# EAGLE design updi_programmer (EAGLE 9.5.2)
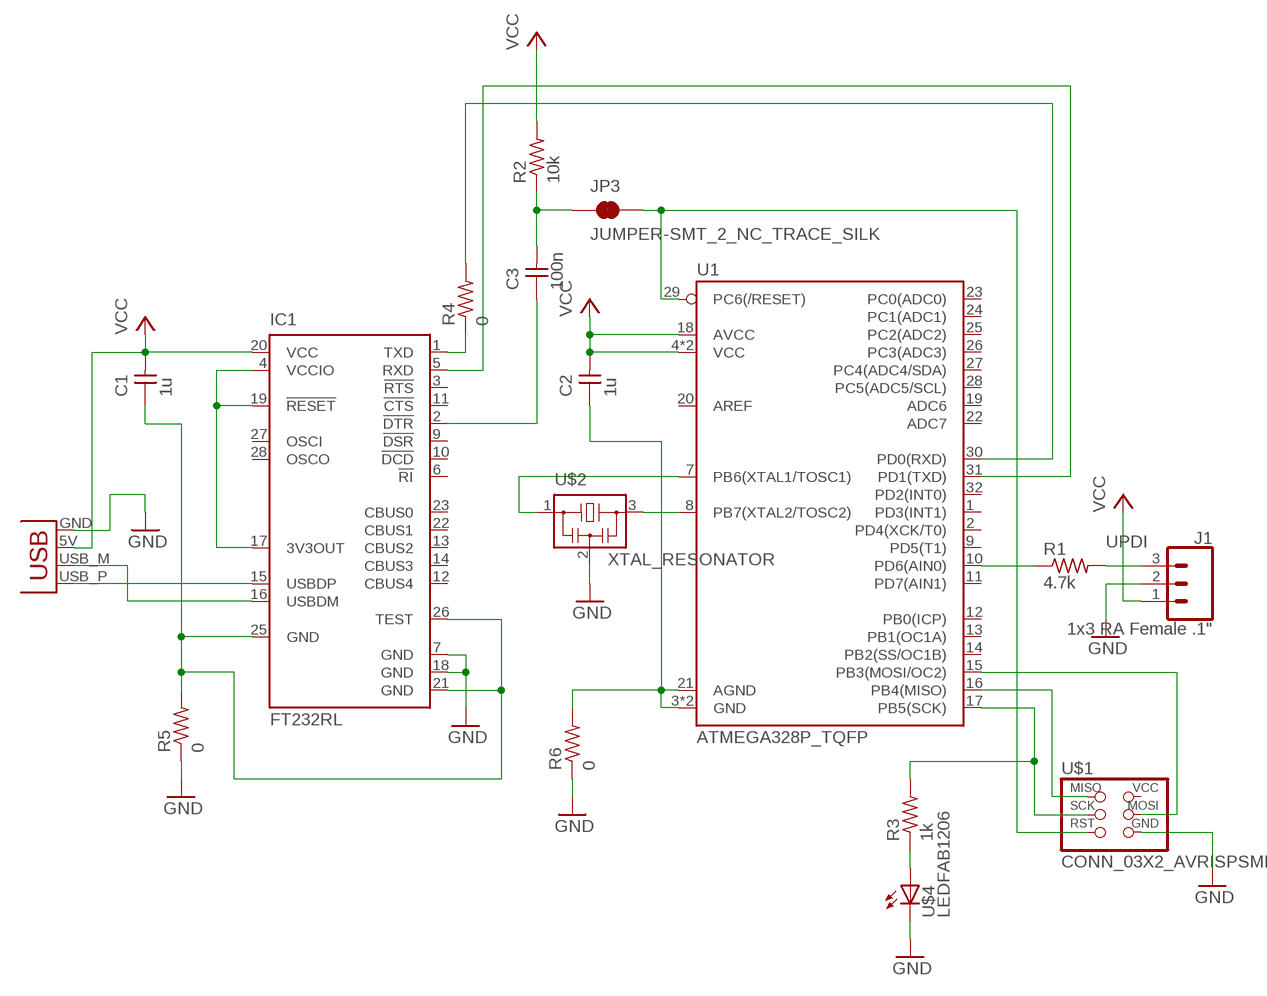
[diagram p0: schematic, sheet 1]

## Parts
C1  1u  CAP_UNPOLARIZEDFAB  [C1206FAB]
C2  1u  CAP_UNPOLARIZEDFAB  [C1206FAB]
C3  100n  CAP_UNPOLARIZEDFAB  [C1206FAB]
IC1  FT232RL  [SSOP28]
J1  1x3 RA Female .1"  CONN_03SMD_RA_FEMALE  [1X03_SMD_RA_FEMALE]
JP3  JUMPER-SMT_2_NC_TRACE_SILK  [SMT-JUMPER_2_NC_TRACE_SILK]
R1  4.7k  R1206FAB  [R1206FAB]
R2  10k  R1206FAB  [R1206FAB]
R3  1k  R1206FAB  [R1206FAB]
R4  0  R1206FAB  [R1206FAB]
R5  0  R1206FAB  [R1206FAB]
R6  0  R1206FAB  [R1206FAB]
U1  ATMEGA328P_TQFP  [TQFP32-08]
U$1  CONN_03X2_AVRISPSMD  [2X03SMD]
U$2  XTAL_RESONATOR  [EFOBM]
U$4  LEDFAB1206  [LED1206FAB]
X1  CONN_USBPCB  [USB-A-PCB]

## Nets
GND: IC1.7(GND) IC1.18(GND) J1.2 R5.1 R6.1 U$1.6(GND) U$2.2 U$4.2(C) X1.GND
N$1: IC1.1(TXD) R4.1
N$2: IC1.4(VCCIO) IC1.17(3V3OUT) IC1.19(!RESET)
N$3: IC1.15(USBDP) X1.USB_P(D+)
N$4: IC1.16(USBDM) X1.USB_M(D-)
N$5: U1.8(PB7(XTAL2/TOSC2)) U$2.3
N$6: U1.7(PB6(XTAL1/TOSC1)) U$2.1
N$7: R3.1 U$4.1(A)
N$8: C3.2 JP3.1 R2.1
N$9: U1.16(PB4(MISO)) U$1.1(MISO)
N$10: R1.1 U1.10(PD6(AIN0))
N$11: R3.2 U1.17(PB5(SCK)) U$1.3(SCK)
N$12: U1.15(PB3(MOSI/OC2)) U$1.4(MOSI)
N$13: JP3.2 U1.29(PC6(/RESET)) U$1.5(RST)
N$14: C3.1 IC1.2(!DTR)
N$15: R4.2 U1.30(PD0(RXD))
N$16: IC1.5(RXD) U1.31(PD1(TXD))
N$17: C2.1 R6.2 U1.3(GND) U1.5(GND) U1.21(AGND)
N$18: C1.1 IC1.21(GND) IC1.25(GND) IC1.26(TEST) R5.2
UPDI: J1.3 R1.2
VCC: C1.2 C2.2 IC1.20(VCC) J1.1 R2.2 U1.4(VCC) U1.6(VCC) U1.18(AVCC) X1.5V(VBUS)
Unconnected: IC1.3(!RTS) IC1.6(!RI) IC1.9(!DSR) IC1.10(!DCD) IC1.11(!CTS) IC1.12(CBUS4) IC1.13(CBUS2) IC1.14(CBUS3) IC1.22(CBUS1) IC1.23(CBUS0) IC1.27(OSCI) IC1.28(OSCO) U1.1(PD3(INT1)) U1.2(PD4(XCK/T0)) U1.9(PD5(T1)) U1.11(PD7(AIN1)) U1.12(PB0(ICP)) U1.13(PB1(OC1A)) U1.14(PB2(SS/OC1B)) U1.19(ADC6) U1.20(AREF) U1.22(ADC7) U1.23(PC0(ADC0)) U1.24(PC1(ADC1)) U1.25(PC2(ADC2)) U1.26(PC3(ADC3)) U1.27(PC4(ADC4/SDA)) U1.28(PC5(ADC5/SCL)) U1.32(PD2(INT0)) U$1.2(VCC)

## Library data of the parts
C1-C3 = fab:CAP_UNPOLARIZED
IC1 = ftdichip:FT232R: Source: http://www.ftdichip.com/Documents/DataSheets/DS_FT232R_v104.pdf; MPN: FT232RL; OC_FARNELL: 1146032; OC_NEWARK: 91K9918
J1 = SparkFun-Connectors:CONN_03: Multi connection point. Often used as Generic Header-pin footprint for 0.1 inch spaced/style header connections On any of the 0.1 inch spaced packages, you can populate with these: Break Away Headers - Straight <https://www.sparkfun.com/products/116> (PRT-00116) Break Away Male Headers - Right Angle <https://www.sparkfun.com/products/553> (PRT-00553) Female Headers <https://www.sparkfun.com/products/115> (PRT-00115) Break Away Headers - Machine Pin <https://www.sparkfun.com/products/117> (PRT-00117) Break Away Female Headers - Swiss Machine Pin <https://www.sparkfun.com/products/743> (PRT-00743) Stackable Header - 3 Pin (Female, 0.1") <https://www.sparkfun.com/products/13875> (PRT-13875) For SCREWTERMINALS and SPRING TERMINALS visit here: Screw Terimnals on SparkFun.com <https://www.sparkfun.com/search/results?term=Screw+Terminals> (5mm/3.5mm/2.54mm spacing) This device is also useful as a general connection point to wire up your design to another part of your project. Our various solder wires solder well into these plated through hole pads. Hook-Up Wire - Assortment (Stranded, 22 AWG) <https://www.sparkfun.com/products/11375> (PRT-11375) Hook-Up Wire - Assortment (Solid Core, 22 AWG) <https://www.sparkfun.com/products/11367> (PRT-11367) View the entire wire category on our website here <https://www.sparkfun.com/categories/141> Special notes: Molex polarized connector foot print use with SKU : PRT-08232 with associated crimp pins and housings.; PROD_ID: CONN-10926
JP3 = SparkFun-Jumpers:JUMPER-SMT_2_NC_TRACE: Normally closed trace jumper This jumper has a trace between two pads so it's normally closed (NC). Use a razor knife to open the connection. For best results follow the IPC guidelines for cutting traces: Cutout at least 0.063 mm (0.005 in). Remove all loose material to clean up the cut area. Seal the cut with an approved epoxy. Reapply solder to reclose the connection.
R1-R6 = fab:R: Resistor (US Symbol) Variants with postfix FAB are widened to allow the routing of internal traces
U1 = SparkFun-IC-Microcontroller:ATMEGA328P_TQFP: Popular 328P in QFP Storefront component: ATmega328 - TQFP <https://www.sparkfun.com/products/13448> (COM-13448) Datasheet <http://www.sparkfun.com/datasheets/Components/SMD/ATMega328.pdf> SparkFun Products SparkFun RedBoard - Programmed with Arduino <https://www.sparkfun.com/products/12757> (DEV-12757) Arduino Pro Mini 328 - 5V/16MHz <https://www.sparkfun.com/products/11113> (DEV-11113) Arduino Pro Mini 328 - 3.3V/8MHz <https://www.sparkfun.com/products/11114> (DEV-11114) SparkFun OpenLog <https://www.sparkfun.com/products/13712> (DEV-13712) SparkFun MicroView - OLED Arduino Module <https://www.sparkfun.com/products/12923> (DEV-12923) SparkFun Digital Sandbox <https://www.sparkfun.com/products/12651> (DEV-12651) SparkFun PicoBoard <https://www.sparkfun.com/products/11888> (WIG-11888) Arduino Fio <https://www.sparkfun.com/products/10116> (DEV-10116) LilyPad Arduino 328 Main Board <https://www.sparkfun.com/products/13342> (DEV-13342) SparkFun RedStick <https://www.sparkfun.com/products/13741> (DEV-13741) LilyPad MP3 <https://www.sparkfun.com/products/11013> (DEV-11013) LilyPad Arduino SimpleSnap <https://www.sparkfun.com/products/10941> (DEV-10941) SparkFun Stepoko <https://www.sparkfun.com/products/13899> (ROB-13899) SparkFun Geiger Counter <https://www.sparkfun.com/products/11345> (SEN-11345) SparkFun EL Sequencer <https://www.sparkfun.com/products/12781> (COM-12781) Arduino Pro 328 - 5V/16MHz <https://www.sparkfun.com/products/10915> (DEV-10915) CryptoCape <https://www.sparkfun.com/products/12773> (DEV-12773) SparkFun IR Thermometer Evaluation Board - MLX90614 <https://www.sparkfun.com/products/10740> (SEN-10740) SparkFun RedBot Mainboard <https://www.sparkfun.com/products/12097> (ROB-12097) Arduino Pro 328 - 3.3V/8MHz <https://www.sparkfun.com/products/10914> (DEV-10914) SparkFun Block for Intel® Edison - Arduino <https://www.sparkfun.com/products/13036> (DEV-13036) SparkFun Simon Says - Surface Mount Soldering Kit <https://www.sparkfun.com/products/10935> (KIT-10935) SparkFun 7-Segment Serial Display - Red <https://www.sparkfun.com/products/11441> (COM-11441) SparkFun 7-Segment Serial Display - White <https://www.sparkfun.com/products/11629> (COM-11629) SparkFun 7-Segment Serial Display - Yellow <https://www.sparkfun.com/products/11443> (COM-11443) SparkFun 7-Segment Serial Display - Kelly Green <https://www.sparkfun.com/products/11440> (COM-11440) SparkFun 7-Segment Serial Display - Blue <https://www.sparkfun.com/products/11442> (COM-11442) SparkFun OpenSegment Serial Display - 20mm (Blue) <https://www.sparkfun.com/products/11647> (COM-11647) SparkFun OpenSegment Serial Display - 20mm (Green) <https://www.sparkfun.com/products/11646> (COM-11646) SparkFun OpenSegment Serial Display - 20mm (White) <https://www.sparkfun.com/products/11648> (COM-11648) SparkFun OpenSegment Serial Display - 20mm (Red) <https://www.sparkfun.com/products/11644> (COM-11644) SparkFun OpenSegment Serial Display - 20mm (Yellow) <https://www.sparkfun.com/products/11645> (COM-11645) SparkFun OpenSegment Shield <https://www.sparkfun.com/products/13190> (DEV-13190); PROD_ID: IC-09069
U$1 = fab:CONN_03X2_AVRISP
U$2 = fab:XTAL_RESONATOR
U$4 = fab:LED: LED
X1 = fab:CONN_USB: USB Connectors USB-B-PTH is fully proven SKU : PRT-00139 USB-miniB is fully proven SKU : PRT-00587 USB-A-PCB is untested. USB-A-H is throughly reviewed, but untested. Spark Fun Electronics SKU : PRT-00437 USB-B-SMT is throughly reviewed, but untested. Needs silkscreen touching up. USB-A-S has not been used/tested USB-MB-H has not been used/tested

## Board
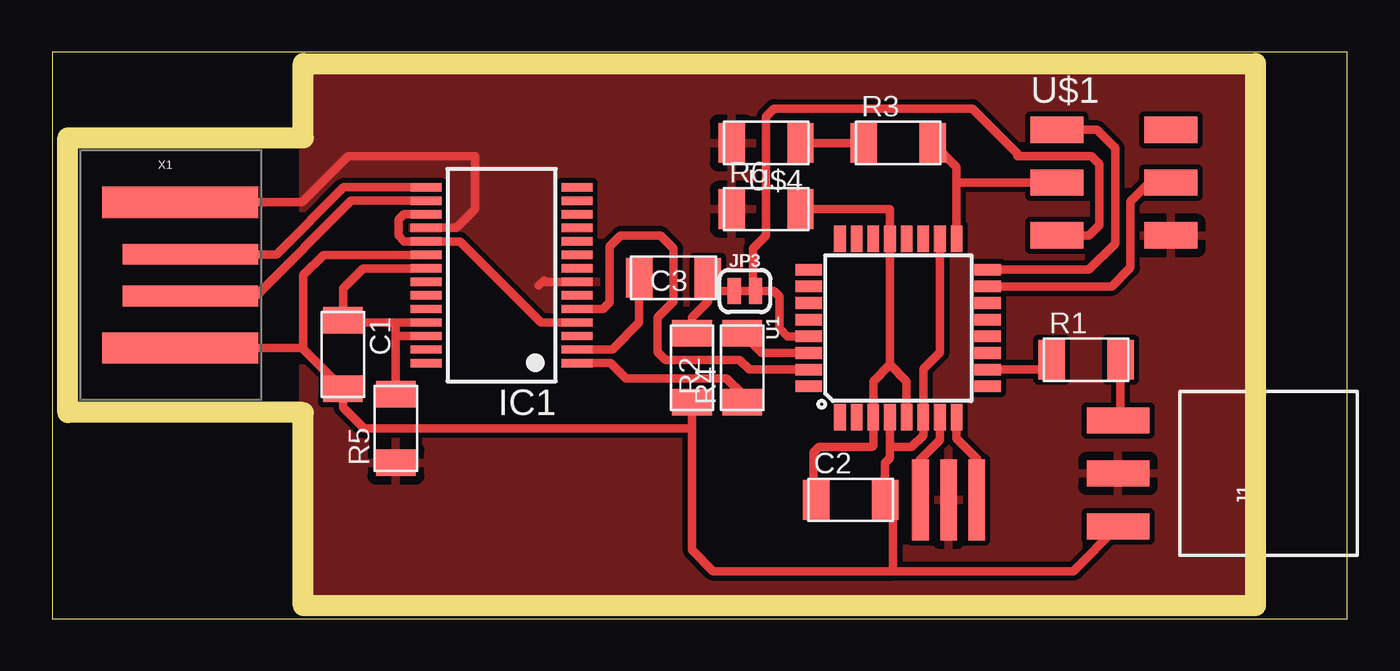
[diagram p1: board, top side]
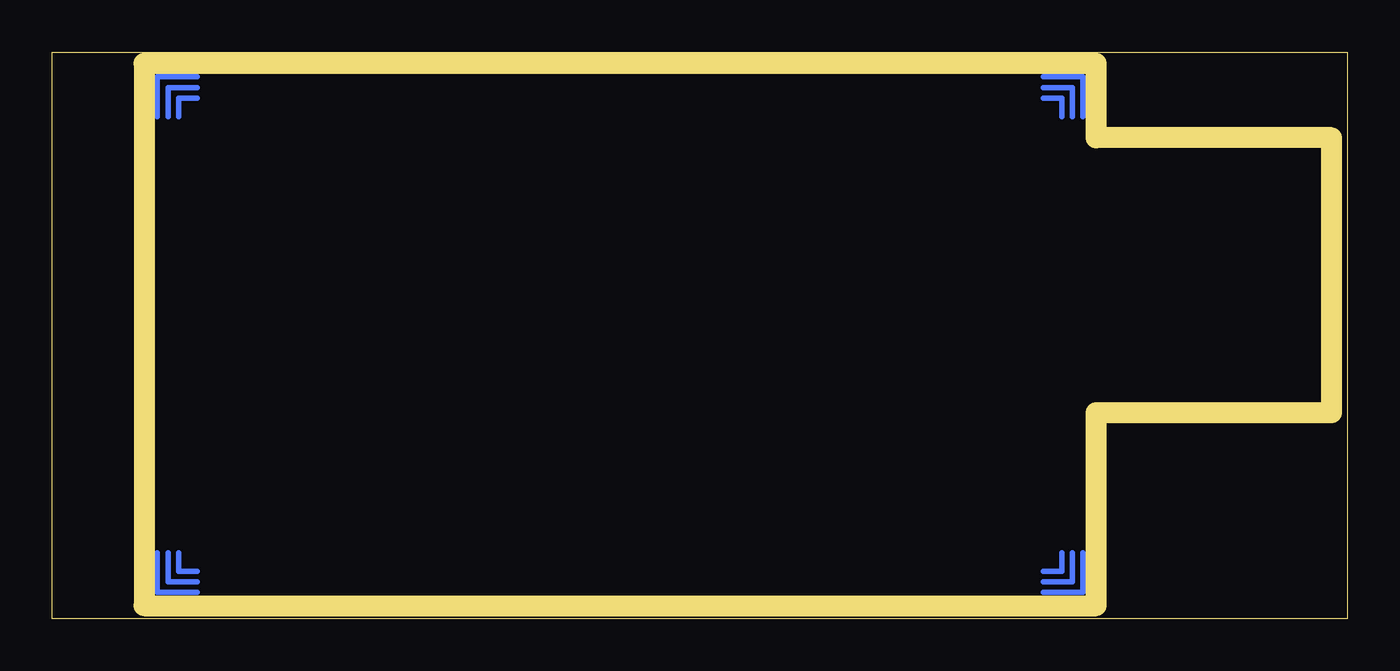
[diagram p2: board, bottom side, seen from below]

Size 62.21 x 27.23 mm. Coordinates in mm from the lower left corner, seen from the top.
Outline: 0,0 62.21,0 62.21,27.23 0,27.23 0,0
Copper layers (1*16): Top 0.035mm / dielectric 1.5mm / Bottom 0.035mm
Design rules "default *": minimum track width 6mil, minimum drill 0.35mm, track to track 8mil, track to pad 8mil, pad to pad 8mil, via to via 8mil, smd to smd 8mil, copper to edge 40mil, drill to drill 6mil, minimum pad ring 10mil, minimum via ring 8mil, stop-mask expansion 4mil, vias tented up to drill 0mil, thermal gap 16mil
Milling: 8 lines

### Footprints (pad centres in the part's own frame; a part is rotated, then mirrored left to right if it is on the bottom)
C1206FAB = smd 1.27 x 1.905: 1 -1.651,0; 2 1.651,0
SSOP28 = smd 0.4 x 1.5: 1 -4.225,-3.625; 2 -3.575,-3.625; 3 -2.925,-3.625; 4 -2.275,-3.625; 5 -1.625,-3.625; 6 -0.975,-3.625; 7 -0.325,-3.625; 8 0.325,-3.625; 9 0.975,-3.625; 10 1.625,-3.625; 11 2.275,-3.625; 12 2.925,-3.625; 13 3.575,-3.625; 14 4.225,-3.625; 15 4.225,3.625; 16 3.575,3.625; 17 2.925,3.625; 18 2.275,3.625; 19 1.625,3.625; 20 0.975,3.625; 21 0.325,3.625; 22 -0.325,3.625; 23 -0.975,3.625; 24 -1.625,3.625; 25 -2.275,3.625; 26 -2.925,3.625; 27 -3.575,3.625; 28 -4.225,3.625
1X03_SMD_RA_FEMALE = smd 1.25 x 3: 1 -2.54,7.225; 2 0,7.225; 3 2.54,7.225
SMT-JUMPER_2_NC_TRACE_SILK = smd 0.635 x 1.27: 1 -0.508,0; 2 0.508,0
R1206FAB = smd 1.27 x 1.905: 1 -1.651,0; 2 1.651,0
TQFP32-08 = smd 1.27 x 0.559: 1 -4.293,2.8; 2 -4.293,2; 3 -4.293,1.2; 4 -4.293,0.4; 5 -4.293,-0.4; 6 -4.293,-1.2; 7 -4.293,-2; 8 -4.293,-2.8; 17 4.293,-2.8; 18 4.293,-2; 19 4.293,-1.2; 20 4.293,-0.4; 21 4.293,0.4; 22 4.293,1.2; 23 4.293,2; 24 4.293,2.8 | smd 0.559 x 1.27: 9 -2.8,-4.293; 10 -2,-4.293; 11 -1.2,-4.293; 12 -0.4,-4.293; 13 0.4,-4.293; 14 1.2,-4.293; 15 2,-4.293; 16 2.8,-4.293; 25 2.8,4.293; 26 2,4.293; 27 1.2,4.293; 28 0.4,4.293; 29 -0.4,4.293; 30 -1.2,4.293; 31 -2,4.293; 32 -2.8,4.293
2X03SMD = smd 2.54 x 1.27: 1 -2.54,2.54; 2 2.92,2.54; 3 -2.54,0; 4 2.92,0; 5 -2.54,-2.54; 6 2.92,-2.54
EFOBM = smd 0.8 x 3.9: 1 -1.35,0; 2 0,0; 3 1.35,0
LED1206FAB = smd 1.27 x 1.905: 1 -1.651,0; 2 1.651,0
USB-A-PCB = smd 7.5 x 1.5: 5V -0.2,-3.5; GND -0.2,3.5 | smd 6.5 x 1: USB_M 0.3,-1; USB_P 0.3,1

### Placement (x,y rotation side)
C1  13.97,12.7 270 top
C2  38.35,5.71 0 top
C3  29.84,16.38 0 top
IC1  21.59,16.51 90 top
J1  58.42,6.99 90 top
JP3  33.27,15.75 0 top
R1  49.66,12.45 0 top
R2  30.73,12.06 270 top
R3  40.64,22.86 0 top
R4  33.15,12.06 90 top
R5  16.51,9.14 90 top
R6  34.29,19.68 0 top
U1  40.64,13.97 90 top
U$1  50.8,20.95 0 top
U$2  43.05,5.71 0 top
U$4  34.29,22.86 180 top
X1  6.35,16.51 0 top

### Tracks (layer width: path | path; a pad name or v marks a point on that pad's centre or on a via)
GND
  Top 0.406: IC1.18 19.42,18.79 20.32,19.68 20.32,22.23 14.22,22.23 12.01,20.01 9.53,20.01 9.21,20.32 3.81,20.32 4.12,20.01 X1.GND | IC1.7 23.69,16.18 23.62,16.26 23.37,16
  pour Top (isolate 0.254): 12.06,0.64 12.06,26.67 57.78,26.67 57.78,0.64
N$1
  Top 0.406: IC1.1 26.83,12.29 27.56,11.56 32.38,11.56 33.15,10.79 R4.1
N$2
  Top 0.406: IC1.4 23.48,14.23 19.58,18.14 IC1.19 16.92,18.14 16.64,18.41 16.64,19.18 16.89,19.43 IC1.17
N$3
  Top 0.406: X1.USB_P 10.78,17.51 14,20.73 IC1.15
N$4
  Top 0.406: X1.USB_M 9.79,15.51 14.37,20.09 IC1.16
N$5
  Top 0.406: U1.8 43.44,8.66 44.45,7.65 44.45,6.99 44.4,6.94 U$2.3
N$6
  Top 0.406: U$2.1 41.66,5.76 41.66,7.62 42.64,8.6 U1.7
N$7
  Top 0.406: R3.1 U$4.1
N$8
  Top 0.406: R2.1 30.73,14.48 31.5,15.24 31.5,15.88 | 32.64,15.75 JP3.1 31.62,15.75 31.5,15.88 | 31.5,15.88 C3.2
N$9
  Top 0.406: U1.16 49.79,16.77 51.05,18.03 51.05,22.61 50.16,23.5 U$1.1
N$10
  Top 0.406: R1.1 47.53,11.97 U1.10
N$11
  Top 0.406: R3.2 43.44,21.71 43.44,20.95 | U1.17 43.44,20.95 | U$1.3 43.44,20.95
N$12
  Top 0.406: U$1.4 52.7,20.95 51.79,20.04 51.79,16.86 50.9,15.97 U1.15
N$13
  Top 0.406: U1.29 35.33,13.57 34.92,13.97 34.92,15.49 34.67,15.75 JP3.2 | JP3.2 33.66,15.88 33.66,17.78 34.29,18.41 34.29,24.13 34.67,24.51 44.2,24.51 46.35,22.35 46.35,22.23 49.91,22.23 50.29,21.84 50.29,18.92 49.78,18.41 U$1.5 | JP3.2 32.77,15.75
N$14
  Top 0.406: IC1.2 26.91,12.94 28.19,14.22 C3.1
N$15
  Top 0.406: U1.30 34.09,12.77 R4.2
N$16
  Top 0.406: IC1.5 26.47,14.88 26.77,15.19 26.77,17.88 27.3,18.41 29.21,18.41 29.84,17.78 29.84,15.24 29.08,14.48 29.08,12.83 29.46,12.45 33.02,12.45 33.5,11.97 U1.31
N$17
  Top 0.406: R6.2 40.24,19.68 U1.21 40.24,12.21 | U1.5 41.04,11.41 40.24,12.21 | 40.24,12.21 39.44,11.41 U1.3 39.44,8.32 39.37,8.26 36.83,8.26 36.58,8 36.58,5.84 C2.1
N$18
  Top 0.406: IC1.25 16.51,14.23 | 16.51,14.23 14.09,14.23 C1.1 13.97,15.88 14.93,16.84 IC1.21 | R5.2 16.51,13.59 | 16.51,13.59 16.51,14.23 | IC1.26 16.51,13.59
N$19
  Bottom 0.254: 12.7,24.13 12.7,26.04 14.61,26.04
N$20
  Bottom 0.254: 13.21,24.13 13.21,25.53 14.61,25.53
N$21
  Bottom 0.254: 14.61,1.27 12.7,1.27 12.7,3.17
N$22
  Bottom 0.254: 14.61,1.78 13.21,1.78 13.21,3.17
N$23
  Bottom 0.254: 55.24,26.04 57.15,26.04 57.15,24.13
N$24
  Bottom 0.254: 55.24,25.53 56.64,25.53 56.64,24.13
N$25
  Bottom 0.254: 57.15,3.17 57.15,1.27 55.24,1.27
N$26
  Bottom 0.254: 56.64,3.17 56.64,1.78 55.24,1.78
N$27
  Bottom 0.254: 13.72,24.13 13.72,25.02 14.61,25.02
N$28
  Bottom 0.254: 14.61,2.29 13.72,2.29 13.72,3.17
N$29
  Bottom 0.254: 55.24,25.02 56.13,25.02 56.13,24.13
N$30
  Bottom 0.254: 56.13,3.17 56.13,2.29 55.24,2.29
UPDI
  Top 0.406: R1.2 51.31,9.64 J1.3
VCC
  Top 0.406: IC1.20 13.04,17.48 12.06,16.51 12.06,12.95 | J1.1 49.04,2.29 40.39,2.29 | 40.39,2.29 31.75,2.29 30.73,3.3 R2.2 30.73,9.14 14.99,9.14 13.97,10.16 C1.2 12.06,12.95 | U1.18 42.64,12.79 41.84,11.99 U1.6 41.84,8.82 41.27,8.26 40.26,8.26 40.24,8.27 | U1.4 40.24,8.27 | 40.24,8.27 40.24,7.73 40.01,7.49 C2.2 40.39,5.33 40.39,2.29 | X1.5V 12.01,13.01 12.06,12.95